# Altium schematic sheet Current_Sense.SchDoc: Current Sense
size Letter; Author: Kevin Chen, Taiping Li; DocumentNumber: 2; SheetNumber: 2; SheetTotal: 4; Website: www.uwmidsun.com
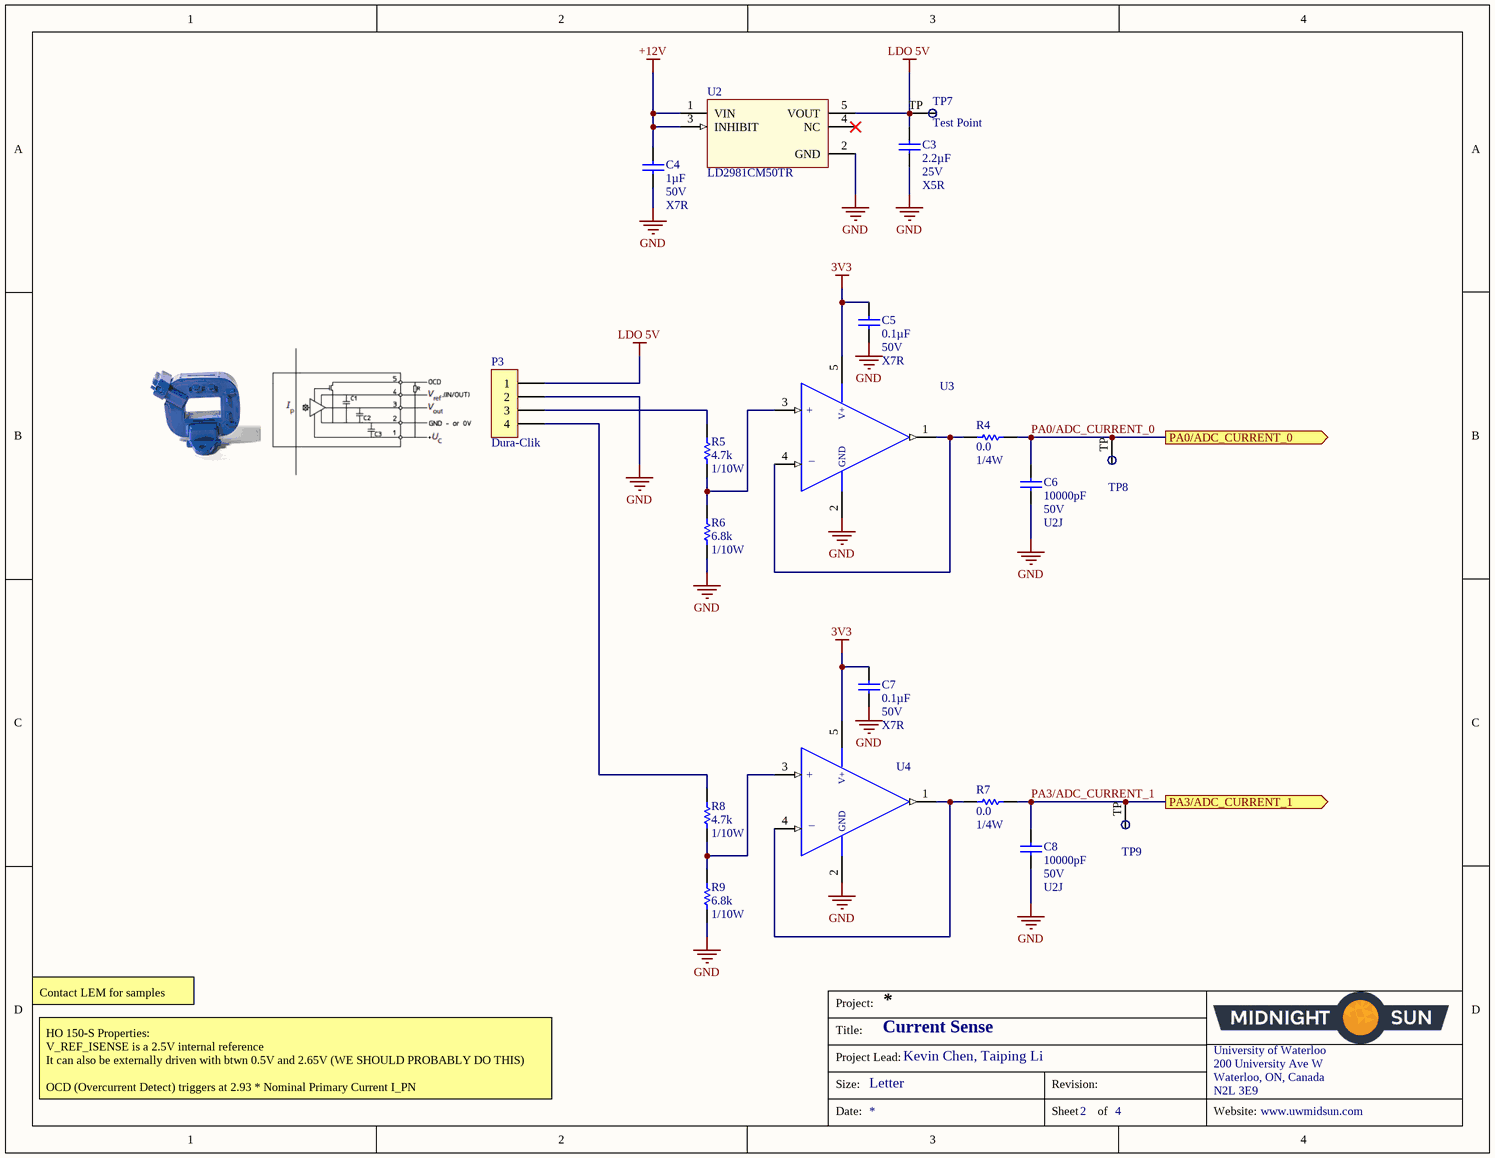
[diagram p0: Current_Sense.SchDoc]

## Parts
C3  Capacitance: 2.2µF  Voltage: 25V  Temperature Coefficient: X5R  [CAP, 0603]  (hidden comment: CAP CER 2.2UF 25V 10% X5R 0603)
C4  Capacitance: 1µF  Voltage: 50V  Temperature Coefficient: X7R  [CAP, 0603]  (hidden comment: CAP CER 1UF 50V 10% X7R 0603)
C5  Capacitance: 0.1µF  Voltage: 50V  Temperature Coefficient: X7R  [CAP, 0603]  (hidden comment: CAP CER 0.1UF 50V 10% X7R 0603)
C6  Capacitance: 10000pF  Voltage: 50V  Temperature Coefficient: U2J  [CAP, 0603]  (hidden comment: CAP CER 10nF 50V 5% X7R 0603)
C7  Capacitance: 0.1µF  Voltage: 50V  Temperature Coefficient: X7R  [CAP, 0603]  (hidden comment: CAP CER 0.1UF 50V 10% X7R 0603)
C8  Capacitance: 10000pF  Voltage: 50V  Temperature Coefficient: U2J  [CAP, 0603]  (hidden comment: CAP CER 10nF 50V 5% X7R 0603)
P3  Dura-Clik  [CONN, 4POS DURA-CLIK VERT]
R4  Resistance: 0.0  Power (Watts): 1/4W  [RES, 0603]  (hidden comment: RES 0.0 OHM 1/4W 0603)
R5  Resistance (Ohms): 4.7k  Power (Watts): 1/10W  [RES, 0603]  (hidden comment: RES 4.7K OHM 1% 1/10W 0603)
R6  Resistance: 6.8k  Power: 1/10W  [RES, 0603]  (hidden comment: RES 6.8k OHM 1% 1/10W 0603)
R7  Resistance: 0.0  Power (Watts): 1/4W  [RES, 0603]  (hidden comment: RES 0.0 OHM 1/4W 0603)
R8  Resistance (Ohms): 4.7k  Power (Watts): 1/10W  [RES, 0603]  (hidden comment: RES 4.7K OHM 1% 1/10W 0603)
R9  Resistance: 6.8k  Power: 1/10W  [RES, 0603]  (hidden comment: RES 6.8k OHM 1% 1/10W 0603)
TP7  Test Point  [Test Point]
TP8  Test Point  [Test Point]  (value not drawn)
TP9  Test Point  [Test Point]  (value not drawn)
U2  Manufacturer Part Number 1: LD2981CM50TR  [SOT95P280X145-5N]  (hidden comment: IC REG LDO 5V 0.1A SOT23-5)
U3  IC OP AMP GEN PURPOSE RR 10MHZ SOT-23-5  [IC OP AMP GP RR 10MHZ SOT-23-5]  (value not drawn)
U4  IC OP AMP GEN PURPOSE RR 10MHZ SOT-23-5  [IC OP AMP GP RR 10MHZ SOT-23-5]  (value not drawn)

## Ports
PA0/ADC_CURRENT_0 (out), PA3/ADC_CURRENT_1 (out)

## Nets
3V3: C5.1 C7.1 U3.5(VDD) U4.5(VDD)
+12V: C4.1 U2.1(VIN) U2.3(INHIBIT)
GND: C3.2 C4.2 C5.2 C6.2 C7.2 C8.2 P3.2 R6.2 R9.2 U2.2(GND) U3.2(VSS) U4.2(VSS)
LDO 5V: C3.1 P3.1 TP7.TP U2.5(VOUT)
PA0/ADC_CURRENT_0: C6.1 R4.2 TP8.TP ; port PA0/ADC_CURRENT_0
PA3/ADC_CURRENT_1: C8.1 R7.2 TP9.TP ; port PA3/ADC_CURRENT_1
NetP3_3: P3.3 R5.1
NetP3_4: P3.4 R8.1
NetR4_1: R4.1 U3.1(OUTPUT) U3.4(-IN)
NetR5_2: R5.2 R6.1 U3.3(+IN)
NetR7_1: R7.1 U4.1(OUTPUT) U4.4(-IN)
NetR8_2: R8.2 R9.1 U4.3(+IN)

Not connected (* = marked no-connect by the designer): U2 4(NC)*

## Notes on the sheet
- Contact LEM for samples
- HO 150-S Properties:
  V_REF_ISENSE is a 2.5V internal reference
  It can also be externally driven with btwn 0.5V and 2.65V (WE SHOULD PROBABLY DO THIS)
  OCD (Overcurrent Detect) triggers at 2.93 * Nominal Primary Current I_PN
- Project:
- Title:
- Size:
- Project Lead:
- Letter
- Revision:
- University of Waterloo
- 200 University Ave W
- Waterloo, ON, Canada
- N2L 3E9
- Date:
- Sheet
- of
- Website:
- (in symbol IC OP AMP GEN PURPOSE RR 10MHZ SOT-23-5) V+; +; GND; _

## Library data of the parts
C3 = CAP CER 2.2UF 25V 10% X5R 0603: 2.2µF ±10% 25V Ceramic Capacitor X5R 0603 (1608 Metric); Manufacturer 1: Murata Electronics North America; Manufacturer Part Number 1: GRM188R61E225KA12D; Supplier 1: Digi-Key; Supplier Part Number 1: 490-10731-1-ND; Packaging: Cut Tape (CT); Part Status: Active; Operating Temperature: -55°C ~ 85°C; Ratings: -; Mounting Type: Surface Mount, MLCC; Package / Case: 0603 (1608 Metric); Size / Dimension: 0.063" L x 0.031" W (1.60mm x 0.80mm); Height - Seated (Max): -; Thickness (Max): 0.035" (0.90mm); Lead Spacing: -; Lead Style: -; ComponentLink1URL: http://www.murata.com/~/media/webrenewal/support/library/catalog/products/capacitor/mlcc/c02e.ashx; ComponentLink1Description: http://www.murata.com/~/media/webrenewal/support/library/catalog/products/capacitor/mlcc/c02e.ashx; Tolerance: ±10%
C4 = CAP CER 1UF 50V 10% X7R 0603: 1µF ±10% 50V Ceramic Capacitor X7R 0603 (1608 Metric); Manufacturer 1: Taiyo Yuden; Manufacturer Part Number 1: UMK107AB7105KA-T; Supplier 1: Digi-Key; Supplier Part Number 1: 587-3247-1-ND; Packaging: Cut Tape (CT); Part Status: Active; Operating Temperature: -55°C ~ 125°C; Ratings: -; Mounting Type: Surface Mount, MLCC; Package / Case: 0603 (1608 Metric); Size / Dimension: 0.063" L x 0.031" W (1.60mm x 0.80mm); Height - Seated (Max): -; Thickness (Max): 0.037" (0.95mm); Lead Spacing: -; Lead Style: -; ComponentLink1URL: http://www.yuden.co.jp/productdata/catalog/en/mlcc_all_e.pdf; ComponentLink1Description: http://www.yuden.co.jp/productdata/catalog/en/mlcc_all_e.pdf; Tolerance: ±10%
C5 C7 = CAP CER 0.1UF 50V 10% X7R 0603: 0.10µF ±10% 50V Ceramic Capacitor X7R 0603 (1608 Metric); Manufacturer 1: AVX Corporation; Manufacturer Part Number 1: 06035C104KAT2A; Supplier 1: Digi-Key; Supplier Part Number 1: 478-5052-1-ND; Packaging: Cut Tape (CT); Part Status: Active; Operating Temperature: -55°C ~ 125°C; Ratings: -; Mounting Type: Surface Mount, MLCC; Package / Case: 0603 (1608 Metric); Size / Dimension: 0.063" L x 0.032" W (1.60mm x 0.81mm); Height - Seated (Max): -; Thickness (Max): 0.035" (0.90mm); Lead Spacing: -; Lead Style: -; ComponentLink1URL: http://datasheets.avx.com/X7RDielectric.pdf; ComponentLink1Description: http://datasheets.avx.com/X7RDielectric.pdf; Tolerance: ±10%
C6 C8 = CAP CER 10nF 50V 5% X7R 0603: 10000pF ±5% 50V Ceramic Capacitor U2J 0603 (1608 Metric); Manufacturer 1: KEMET; Manufacturer Part Number 1: C0603C103J5JAC7867; Supplier 1: Digi-Key; Supplier Part Number 1: 399-13384-1-ND; Packaging: Cut Tape (CT); Part Status: Active; Operating Temperature: -55°C ~ 125°C; Ratings: -; Failure Rate: -; Mounting Type: Surface Mount, MLCC; Package / Case: 0603 (1608 Metric); Size / Dimension: 0.063" L x 0.032" W (1.60mm x 0.80mm); Height - Seated (Max): -; Thickness (Max): 0.034" (0.87mm); Lead Spacing: -; Lead Style: -; ComponentLink1URL: http://www.kemet.com/docfinder?Partnumber=C0603C103J5JAC7867; ComponentLink1Description: http://www.kemet.com/docfinder?Partnumber=C0603C103J5JAC7867; Tolerance: ±5%
P3 = CONN 4POS DURA-CLIK 0.079": 4 Positions Header Connector 0.079" (2.00mm) Surface Mount Tin; Manufacturer: Molex, LLC; Manufacturer Part Number: 5600200420; Style: Board to Cable/Wire; Shrouding: Shrouded - 4 Wall; Number of Positions: 4; Number of Positions Loaded: All; Mated Stacking Heights: 9.3mm; Supplier 1: Digi-Key; RoHS: RoHS Compliant; Category: Connectors, Interconnects; Stock 1: 9367; Pricing 1: 1=2.23, 10=2.022, 25=1.898, 50=1.8156, 100=1.733 (CAD); Packaging: Cut Tape (CT); Part Status: Active; Connector Type: Header; Contact Type: Male Pin; Pitch - Mating: 0.079" (2.00mm); Number of Rows: 1; Row Spacing - Mating: -; Mounting Type: Surface Mount; Termination: Solder; Fastening Type: Latch Lock; Contact Length - Mating: -; Contact Length - Post: -; Overall Contact Length: -; Insulation Height: 0.315" (8.00mm); Contact Shape: Square; Contact Finish - Mating: Tin; Contact Finish Thickness - Mating: -; Contact Finish - Post: Tin; Contact Material: Copper Alloy; Insulation Material: Polyamide (PA), Nylon; Features: Solder Retention; Operating Temperature: -; Ingress Protection: -; Material Flammability Rating: -; Insulation Color: Natural; Current Rating: -; Voltage Rating: -; Contact Finish Thickness - Post: -; Applications: Automotive, Industrial; ComponentLink1URL: http://www.molex.com/pdm_docs/sd/5600200420_sd.pdf; ComponentLink1Description: http://www.molex.com/pdm_docs/sd/5600200420_sd.pdf; Supplier Part Number 1: WM10864CT-ND
R4 R7 = RES 0.0 OHM 1/4W 0603: RES SMD 0.0 OHM JUMPER 1/4W 0603; Manufacturer 1: Vishay Dale; Manufacturer Part Number 1: CRCW06030000Z0EAHP; Supplier 1: Digi-Key; Supplier Part Number 1: 541-0.0SBCT-ND; Packaging: Cut Tape (CT); Part Status: Active; Composition: Thick Film; Operating Temperature: -55°C ~ 155°C; Package / Case: 0603 (1608 Metric); Supplier Device Package: 0603; Size / Dimension: 0.063" L x 0.033" W (1.60mm x 0.85mm); Height - Seated (Max): 0.022" (0.55mm); Failure Rate: -; ComponentLink1URL: http://www.vishay.com/docs/20043/crcwhpe3.pdf; ComponentLink1Description: http://www.vishay.com/docs/20043/crcwhpe3.pdf
R5 R8 = RES 4.7K OHM 1% 1/10W 0603: 4.7k Ohm ±1% 0.1W, 1/10W Chip Resistor 0603 (1608 Metric) Moisture Resistant Thick Film; Manufacturer 1: Yageo; Manufacturer Part Number 1: RC0603FR-074K7L; Description 1: RES SMD 4.7K OHM 1% 1/10W 0603; Temperature Coefficient: ±100ppm/°C; Supplier 1: Digi-Key; Supplier Part Number 1: 311-4.70KHRCT-ND; RoHS: RoHS Compliant; Category: Resistors; Stock 1: 3487566; Pricing 1: 1=0.16, 10=0.022, 100=0.0089, 1000=0.00402, 2500=0.00349 (CAD); Packaging: Cut Tape (CT); Part Status: Active; Composition: Thick Film; Features: Moisture Resistant; Operating Temperature: -55°C ~ 155°C; Package / Case: 0603 (1608 Metric); Supplier Device Package: 0603; Size / Dimension: 0.063" L x 0.031" W (1.60mm x 0.80mm); Height - Seated (Max): 0.022" (0.55mm); Failure Rate: -; ComponentLink1URL: http://www.yageo.com/documents/recent/PYu-RC_Group_51_RoHS_L_7.pdf; ComponentLink1Description: http://www.yageo.com/documents/recent/PYu-RC_Group_51_RoHS_L_7.pdf; Tolerance: ±1%
R6 R9 = RES 6.8k OHM 1% 1/10W 0603: RES SMD 6.8K OHM 1% 1/10W 0603; Manufacturer 1: Stackpole Electronics Inc.; Manufacturer Part Number 1: RMCF0603FT6K80; Temperature Coefficient: ±100ppm/°C; Supplier 1: Digi-Key; Supplier Part Number 1: RMCF0603FT6K80CT-ND; Packaging: Cut Tape (CT); Part Status: Active; Composition: Thick Film; Operating Temperature: -55°C ~ 155°C; Package / Case: 0603 (1608 Metric); Supplier Device Package: 0603; Size / Dimension: 0.061" L x 0.031" W (1.55mm x 0.80mm); Height - Seated (Max): 0.022" (0.55mm); Failure Rate: -; ComponentLink1URL: https://www.seielect.com/Catalog/SEI-RMCF_RMCP.pdf; ComponentLink1Description: https://www.seielect.com/Catalog/SEI-RMCF_RMCP.pdf; Tolerance: ±1%
U2 = IC REG LDO 5V 0.1A SOT23-5: Linear Voltage Regulator IC Positive Fixed Output 5V 100mA SOT-23-5; Manufacturer 1: STMicroelectronics; Voltage - Dropout (Typical): 0.18V @ 100mA; Voltage - Input: Up to 16V; Supplier 1: Digi-Key; Supplier Part Number 1: 497-7787-1-ND; Packaging: Cut Tape (CT); Part Status: Active; Regulator Topology: Positive Fixed; Voltage - Output: 5V; Current - Output: 100mA; Current - Limit (Min): -; Operating Temperature: -40°C ~ 125°C; Mounting Type: Surface Mount; Package / Case: SC-74A, SOT-753; Supplier Device Package: SOT-23-5; ComponentLink1URL: http://www.st.com/content/ccc/resource/technical/document/datasheet/group1/b7/b5/a1/83/9c/bd/4a/90/CD00001635/files/CD00001635.pdf/jcr:content/translations/en.CD00001635.pdf; ComponentLink1Description: http://www.st.com/content/ccc/resource/technical/document/datasheet/group1/b7/b5/a1/83/9c/bd/4a/90/CD00001635/files/CD00001635.pdf/jcr:content/translations/en.CD00001635.pdf
U3 U4 = IC OP AMP GEN PURPOSE RR 10MHZ SOT-23-5: General Purpose Amplifier 1 Circuit Rail-to-Rail SOT-23-5; Manufacturer 1: Texas Instruments; Manufacturer Part Number 1: TLV316QDBVRQ1; Description 1: IC OP AMP GP RR 10MHZ 5-SOT-23; Number of Circuits: 1; Slew Rate: 6 V/µs; Current - Supply: 400µA; Current - Output / Channel: 50mA; Voltage - Supply, Single/Dual (±): 1.8 V ~ 5.5 V, ±0.9 V ~ 2.75 V; Supplier 1: Digi-Key; Supplier Part Number 1: 296-45323-1-ND; RoHS: RoHS Compliant; Category: Integrated Circuits (ICs); Stock 1: 1747; Pricing 1: 1=1.33, 10=1.185, 100=0.9234, 500=0.76276, 1000=0.60218 (CAD); Packaging: Cut Tape (CT); Part Status: Active; Amplifier Type: General Purpose; Output Type: Rail-to-Rail; -3db Bandwidth: -; Operating Temperature: -40°C ~ 125°C; Mounting Type: Surface Mount; Package / Case: SC-74A, SOT-753; Supplier Device Package: SOT-23-5; ComponentLink1URL: http://www.ti.com/lit/ds/symlink/tlv316-q1.pdf; ComponentLink1Description: http://www.ti.com/lit/ds/symlink/tlv316-q1.pdf